# Altium schematic sheet 05_CONNECTORS.SchDoc
size A4; SheetNumber: 2; SheetTotal: 6
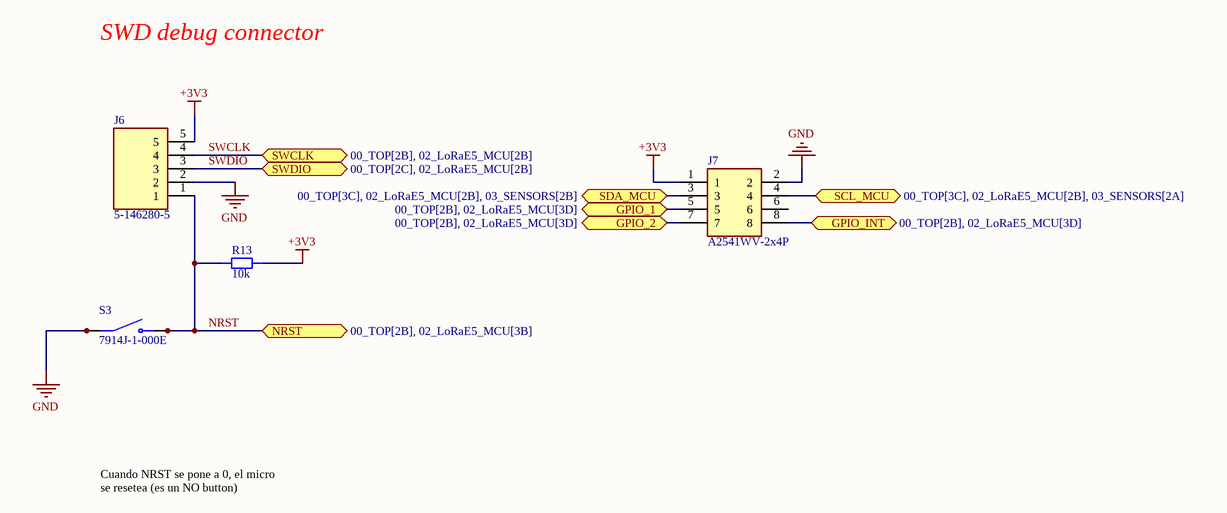
[diagram p0: 05_CONNECTORS.SchDoc]

## Parts
J6  5-146280-5  [HDRV5W67P0X254_1X5_1229X234X821P]
J7  A2541WV-2x4P  [TSW-104-XX-YY-D]
R13  10k  [Resistor_SMD:0603_1608m]
S3  7914J-1-000E  [SW_7914J-1-000E]

## Ports
GPIO_1 (bidir, see 00_TOP[2B], 02_LoRaE5_MCU[3D]), GPIO_2 (bidir, see 00_TOP[2B], 02_LoRaE5_MCU[3D]), GPIO_INT (bidir, see 00_TOP[2B], 02_LoRaE5_MCU[3D]), NRST (bidir, see 00_TOP[2B], 02_LoRaE5_MCU[3B]), SCL_MCU (bidir, see 00_TOP[3C], 02_LoRaE5_MCU[2B], 03_SENSORS[2A]), SDA_MCU (bidir, see 00_TOP[3C], 02_LoRaE5_MCU[2B], 03_SENSORS[2B]), SWCLK (bidir, see 00_TOP[2B], 02_LoRaE5_MCU[2B]), SWDIO (bidir, see 00_TOP[2C], 02_LoRaE5_MCU[2B])

## Nets
+3V3: J6.5 J7.1 R13.2
GND: J6.2 J7.2 S3.1(COM) S3.2(COM)
GPIO_1: J7.5 ; port GPIO_1
GPIO_2: J7.7 ; port GPIO_2
GPIO_INT: J7.8 ; port GPIO_INT
NRST: J6.1 R13.1 S3.3(NO) S3.4(NO) ; port NRST
SCL_MCU: J7.4 ; port SCL_MCU
SDA_MCU: J7.3 ; port SDA_MCU
SWCLK: J6.4 ; port SWCLK
SWDIO: J6.3 ; port SWDIO

Not connected (* = marked no-connect by the designer): J7 6

## Notes on the sheet
- SWD debug connector
- Cuando NRST se pone a 0, el micro se resetea (es un NO button)

## Library data of the parts
J6 = 5-146280-5: TE CONNECTIVITY - 5-146280-5 - CONNECTOR, BOARD-TO-BOARD 07AH5929; Geometry.Height: 8.21mm; Manufacturer_Name: TE Connectivity; Manufacturer_Part_Number: 5-146280-5; Mouser Part Number: 571-5-146280-5; Mouser Price/Stock: https://www.mouser.co.uk/ProductDetail/TE-Connectivity/5-146280-5?qs=bwpFY26eRVfu6g6nYAoViA%3D%3D; Arrow Part Number: 5-146280-5; Arrow Price/Stock: https://www.arrow.com/en/products/5-146280-5/te-connectivity?utm_currency=USD&region=nac; Datasheet Link: https://www.te.com/commerce/DocumentDelivery/DDEController?Action=showdoc&DocId=Customer+Drawing%7F146280%7FH2%7Fpdf%7FEnglish%7FENG_CD_146280_H2.pdf%7F5-146280-5
J7 = TSW-104-07-T-D: Manufacturer_Name: SAMTEC; Manufacturer_Part_Number: TSW-104-07-T-D; Mouser Part Number: 200-TSW10407TD; Mouser Price/Stock: https://www.mouser.co.uk/ProductDetail/Samtec/TSW-104-07-T-D?qs=hzq9O0YpnZtBZCcLzm8dag%3D%3D; Arrow Part Number: TSW-104-07-T-D; Arrow Price/Stock: https://www.arrow.com/en/products/tsw-104-07-t-d/samtec?utm_currency=USD&region=europe; Datasheet Link: http://suddendocs.samtec.com/prints/tsw-xxx-xx-xxx-x-xx-xxx-mkt.pdf
R13 = Generic Resistor
S3 = 7914J-1-000E: Switch Tactile N.O. SPST Round Button J-Hook 0.1A 16VAC 16VDC 100000Cycles 2.94N SMD T/R; MF: Bourns; MP: 7914J-1-000E.; SnapEDA_Link: https://www.snapeda.com/parts/7914J-1-000E./Bourns/view-part/?ref=snap; Package: None; Value: *; Check_prices: https://www.snapeda.com/parts/7914J-1-000E./Bourns/view-part/?ref=eda